# Altium schematic sheet TPIC6B595_CommunicationInterface.SchDoc
size A4
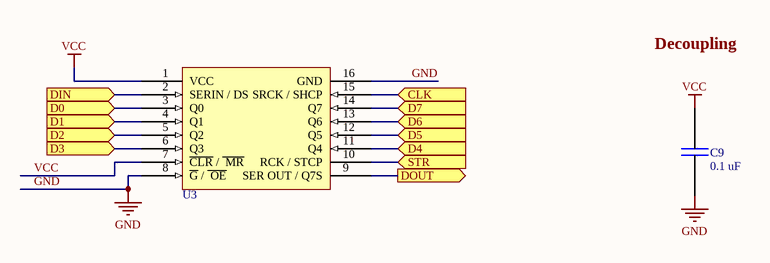
[diagram p0: TPIC6B595_CommunicationInterface.SchDoc]

## Parts
C9  value 0.1 uF  [CAP0603]  (hidden comment: CAP0.1uF)
U3  POWER SHIFT REG  [NPIC6C595_Q100_SOIC16]  (value not drawn)

## Ports
CLK (in), D0 (in), D1 (in), D2 (in), D3 (in), D4 (in), D5 (in), D6 (in), D7 (in), DIN (in), DOUT (out), STR (in)

## Nets
GND: C9.2 U3.8(~{G}_/_~{_OE}) U3.16(GND)
VCC: C9.1 U3.1(VCC) U3.7(~{CLR}_/_~{_MR})
CLK: U3.15(SRCK_/_SHCP) ; port CLK
D0: U3.3(Q0) ; port D0
D1: U3.4(Q1) ; port D1
D2: U3.5(Q2) ; port D2
D3: U3.6(Q3) ; port D3
D4: U3.11(Q4) ; port D4
D5: U3.12(Q5) ; port D5
D6: U3.13(Q6) ; port D6
D7: U3.14(Q7) ; port D7
DIN: U3.2(SERIN_/_DS) ; port DIN
DOUT: U3.9(SER_OUT_/_Q7S) ; port DOUT
STR: U3.10(RCK_/_STCP) ; port STR

## Notes on the sheet
- Labels drawn without touching a wire or pin: Decoupling

## Library data of the parts
C9 = C0.1UF: Capacitores cerámicos de capas múltiples (MLCC) - SMD/SMT 0603 0.1uF 16volts X7R 5%; MPN: VJ0603Y104JXJPW1BC; Supplier PN: 77-VJ0603Y104JXJPBC; Supplier: Mouser
U3 = TPIC6C595DR / NPIC6C595D: Registros de cambio de contadores 8bit Shift; MPN: NPIC6C595D-Q100; Value: 8 bits shift register; Supplier: Mouser; Supplier PN: 771-NPIC6C595D-Q100; Supplier PN1: 595-TPIC6C595DR; MPN1: TPIC6C595DR